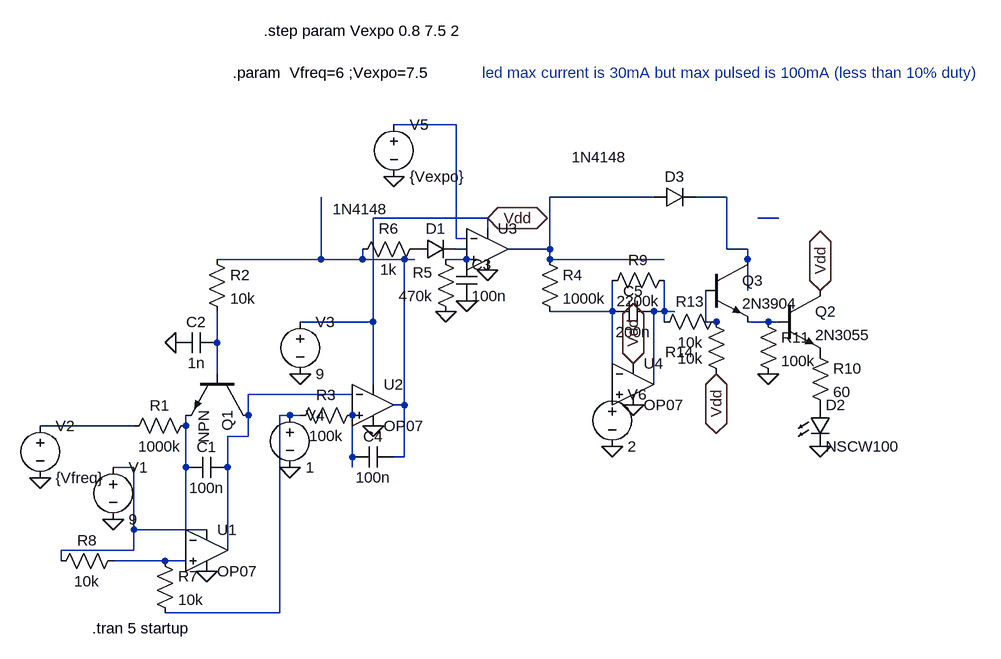
[diagram p0: schematic stroboscopeAnalog.asc]
stroboscopeAnalog.asc, the LTspice schematic file:
Version 4
SHEET 1 1344 680
WIRE 464 -448 368 -448
WIRE 768 -336 608 -336
WIRE 880 -336 832 -336
WIRE 512 -304 336 -304
WIRE 960 -304 928 -304
WIRE 512 -288 512 -304
WIRE 464 -272 464 -448
WIRE 480 -272 464 -272
WIRE 480 -256 464 -256
WIRE 608 -256 608 -336
WIRE 608 -256 544 -256
WIRE 880 -256 880 -336
WIRE 912 -256 880 -256
WIRE 256 -240 256 -336
WIRE 256 -240 96 -240
WIRE 320 -240 320 -256
WIRE 320 -240 256 -240
WIRE 384 -240 320 -240
WIRE 400 -240 384 -240
WIRE 480 -240 480 -256
WIRE 480 -240 448 -240
WIRE 496 -240 480 -240
WIRE 608 -240 608 -256
WIRE 784 -240 608 -240
WIRE 912 -240 912 -256
WIRE 912 -192 912 -240
WIRE 704 -160 704 -208
WIRE 704 -160 608 -160
WIRE 784 -160 784 -208
WIRE 784 -160 768 -160
WIRE 800 -160 784 -160
WIRE 336 -144 336 -304
WIRE 336 -144 224 -144
WIRE 784 -144 784 -160
WIRE 848 -144 848 -192
WIRE 864 -144 848 -144
WIRE 944 -144 912 -144
WIRE 960 -144 944 -144
WIRE 96 -112 96 -160
WIRE 96 -64 96 -112
WIRE 704 -64 704 -160
WIRE 336 -48 336 -144
WIRE 768 -48 768 -160
WIRE 304 -32 144 -32
WIRE 384 -16 384 -240
WIRE 384 -16 368 -16
WIRE 144 0 144 -32
WIRE 208 0 192 0
WIRE 224 0 208 0
WIRE -32 16 -176 16
WIRE 48 16 48 0
WIRE 144 32 144 0
WIRE 144 32 112 32
WIRE 304 64 304 0
WIRE 384 64 384 -16
WIRE 384 64 368 64
WIRE -32 80 -64 80
WIRE 48 80 48 16
WIRE 112 80 112 32
WIRE 304 80 304 64
WIRE -32 176 -32 80
WIRE 80 176 -32 176
WIRE 48 192 48 80
WIRE -32 208 -32 176
WIRE -32 208 -144 208
WIRE 112 208 112 80
WIRE -144 224 -144 208
WIRE 16 224 -64 224
WIRE 48 224 16 224
WIRE 192 304 192 0
WIRE 192 304 16 304
FLAG 80 240 0
FLAG -64 160 0
FLAG 208 80 0
FLAG 224 -64 0
FLAG 336 16 0
FLAG 32 -112 0
FLAG 512 -224 0
FLAG 480 -176 0
FLAG 368 -368 0
FLAG 448 -160 0
FLAG -176 96 0
FLAG 736 -16 0
FLAG 736 -80 Vdd
IOPIN 736 -80 BiDir
FLAG 512 -304 Vdd
IOPIN 512 -304 BiDir
FLAG 704 48 0
FLAG 1024 48 0
FLAG 944 -64 0
FLAG 1024 -192 Vdd
IOPIN 1024 -192 BiDir
FLAG 864 -64 Vdd
IOPIN 864 -64 BiDir
SYMBOL Opamps\\OP07 80 144 R0
SYMATTR InstName U1
SYMBOL voltage -64 64 R0
WINDOW 123 0 0 Left 0
WINDOW 39 0 0 Left 0
SYMATTR InstName V1
SYMATTR Value 9
SYMBOL res 64 0 R90
WINDOW 0 0 56 VBottom 2
WINDOW 3 32 56 VTop 2
SYMATTR InstName R1
SYMATTR Value 1000k
SYMBOL cap 112 64 R90
WINDOW 0 0 32 VBottom 2
WINDOW 3 32 32 VTop 2
SYMATTR InstName C1
SYMATTR Value 100n
SYMBOL npn 144 -64 R90
SYMATTR InstName Q1
SYMBOL res 80 -256 R0
SYMATTR InstName R2
SYMATTR Value 10k
SYMBOL Opamps\\OP07 336 -80 R0
SYMATTR InstName U2
SYMBOL res 320 -16 R90
WINDOW 0 0 56 VBottom 2
WINDOW 3 32 56 VTop 2
SYMATTR InstName R3
SYMATTR Value 100k
SYMBOL voltage 224 -160 R0
WINDOW 123 0 0 Left 0
WINDOW 39 0 0 Left 0
SYMATTR InstName V3
SYMATTR Value 9
SYMBOL voltage 208 -16 R0
WINDOW 123 0 0 Left 0
WINDOW 39 0 0 Left 0
SYMATTR InstName V4
SYMATTR Value 1
SYMBOL cap 96 -128 R90
WINDOW 0 0 32 VBottom 2
WINDOW 3 32 32 VTop 2
SYMATTR InstName C2
SYMATTR Value 1n
SYMBOL res 464 -144 R180
WINDOW 0 36 76 Left 2
WINDOW 3 36 40 Left 2
SYMATTR InstName R5
SYMATTR Value 470k
SYMBOL cap 464 -240 R0
SYMATTR InstName C3
SYMATTR Value 100n
SYMBOL voltage 368 -464 R0
WINDOW 123 0 0 Left 0
WINDOW 39 0 0 Left 0
SYMATTR InstName V5
SYMATTR Value {Vexpo}
SYMBOL Opamps\\UniversalOpamp2 512 -256 R0
SYMATTR InstName U3
SYMBOL diode 400 -240 R270
WINDOW 0 32 32 VTop 2
WINDOW 3 93 -84 VBottom 2
SYMATTR InstName D1
SYMATTR Value 1N4148
SYMBOL res 416 -272 R90
WINDOW 0 0 56 VBottom 2
WINDOW 3 32 56 VTop 2
SYMATTR InstName R6
SYMATTR Value 1k
SYMBOL res 0 208 R0
SYMATTR InstName R7
SYMATTR Value 10k
SYMBOL res -48 208 R90
WINDOW 0 0 56 VBottom 2
WINDOW 3 32 56 VTop 2
SYMATTR InstName R8
SYMATTR Value 10k
SYMBOL cap 368 48 R90
WINDOW 0 0 32 VBottom 2
WINDOW 3 32 32 VTop 2
SYMATTR InstName C4
SYMATTR Value 100n
SYMBOL voltage -176 0 R0
WINDOW 123 0 0 Left 0
WINDOW 39 0 0 Left 0
SYMATTR InstName V2
SYMATTR Value {Vfreq}
SYMBOL cap 768 -176 R90
WINDOW 0 0 32 VBottom 2
WINDOW 3 32 32 VTop 2
SYMATTR InstName C5
SYMATTR Value 200n
SYMBOL res 592 -256 R0
SYMATTR InstName R4
SYMATTR Value 1000k
SYMBOL Opamps\\OP07 736 -112 R0
SYMATTR InstName U4
SYMBOL voltage 704 -48 R0
WINDOW 123 0 0 Left 0
WINDOW 39 0 0 Left 0
SYMATTR InstName V6
SYMATTR Value 2
SYMBOL res 800 -224 R90
WINDOW 0 0 56 VBottom 2
WINDOW 3 32 56 VTop 2
SYMATTR InstName R9
SYMATTR Value 2200k
SYMBOL res 1008 -112 R0
SYMATTR InstName R10
SYMATTR Value 60
SYMBOL LED 1008 -16 R0
SYMATTR InstName D2
SYMATTR Value NSCW100
SYMBOL npn 960 -192 R0
SYMATTR InstName Q2
SYMATTR Value 2N3055
SYMBOL res 928 -160 R0
SYMATTR InstName R11
SYMATTR Value 100k
SYMBOL res 880 -160 R90
WINDOW 0 0 56 VBottom 2
WINDOW 3 32 56 VTop 2
SYMATTR InstName R13
SYMATTR Value 10k
SYMBOL res 880 -48 R180
WINDOW 0 50 50 Left 2
WINDOW 3 36 40 Left 2
SYMATTR InstName R14
SYMATTR Value 10k
SYMBOL diode 768 -320 R270
WINDOW 0 32 32 VTop 2
WINDOW 3 93 -84 VBottom 2
SYMATTR InstName D3
SYMATTR Value 1N4148
SYMBOL npn 848 -240 R0
SYMATTR InstName Q3
SYMATTR Value 2N3904
TEXT -96 328 Left 2 !.tran 5 startup
TEXT 168 -592 Left 2 !.step param Vexpo 0.8 7.5 2
TEXT 504 -528 Left 2 ;led max current is 30mA but max pulsed is 100mA (less than 10% duty)
TEXT 120 -528 Left 2 !.param  Vfreq=6 ;Vexpo=7.5

The netlist it stands for:
* stroboscopeAnalog.asc
XU1 N018 N015 N017 0 N012 LT1001  ; OP07, pins In+ In- V+ V- OUT
V1 N017 0 9
R1 N015 N014 1000k
C1 N012 N015 100n
Q1 N012 N011 N015 0 NPN
R2 N006 N011 10k
XU2 N016 N012 Vdd 0 N006 LT1001  ; OP07, pins In+ In- V+ V- OUT
R3 N016 N013 100k
V3 Vdd 0 9
V4 N013 0 1
C2 N011 0 1n
R5 0 N005 470k
C3 N005 0 100n
V5 N001 0 {Vexpo}
XU3 N005 N001 Vdd 0 N002 level.2 Avol=1Meg GBW=10Meg Slew=10Meg ilimit=25m rail=0 Vos=0 phimargin=45 en=0 enk=0 in=0 ink=0 Rin=500Meg  ; pins IN+ IN- V+ V- OUT
D1 P001 N005 1N4148
R6 P001 N006 1k
R7 N018 N013 10k
R8 N018 N017 10k
C4 N006 N016 100n
V2 N014 0 {Vfreq}
C5 N008 N007 200n
R4 N002 N007 1000k
XU4 P002 N007 Vdd 0 N008 LT1001  ; OP07, pins In+ In- V+ V- OUT
V6 P002 0 2
R9 N008 N007 2200k
R10 P003 P004 60
D2 P004 0 NSCW100
Q2 Vdd N010 P003 0 2N3055
R11 N010 0 100k
R13 N009 N008 10k
R14 Vdd N009 10k
D3 N002 N003 1N4148
Q3 N003 N009 N010 0 2N3904
.model D D
.lib standard.dio
.model NPN NPN
.model PNP PNP
.lib standard.bjt
.tran 5 startup
.step param Vexpo 0.8 7.5 2
* led max current is 30mA but max pulsed is 100mA (less than 10% duty)
.param  Vfreq=6 ;Vexpo=7.5
.lib LTC.lib
.lib UniversalOpamps2.sub
.backanno
.end